# Altium schematic sheet CAN.SchDoc
size A4; DocumentNumber: 6; SheetNumber: 6; SheetTotal: 8
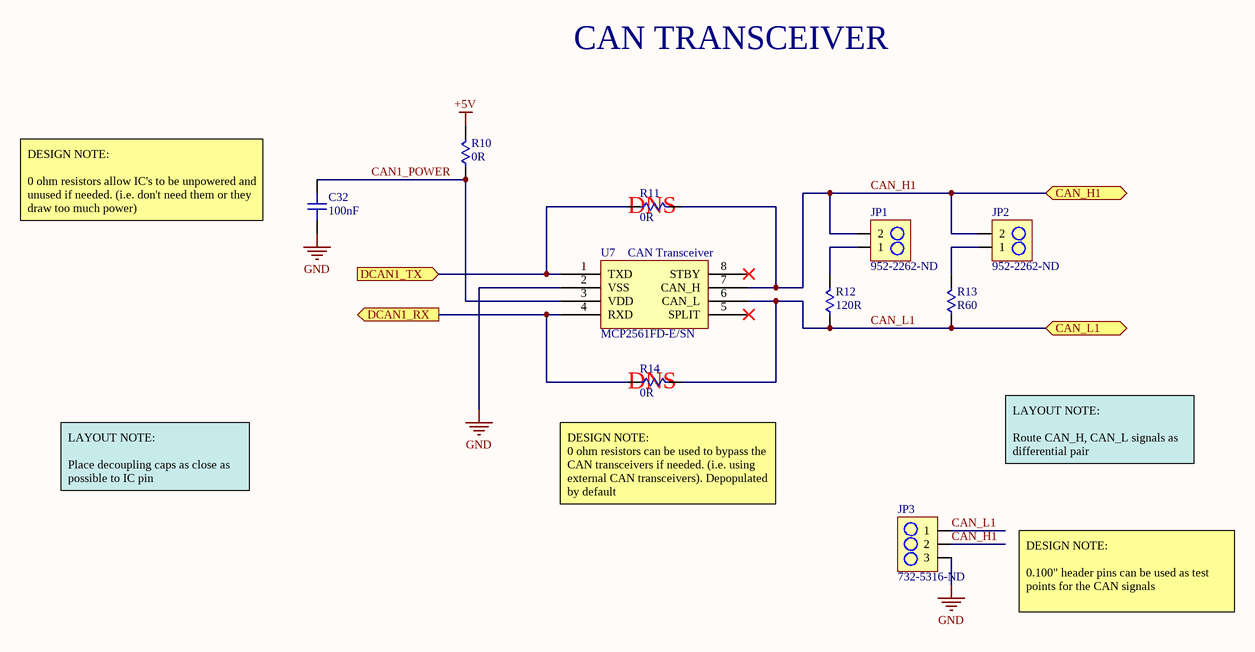
[diagram p0: CAN.SchDoc]

## Parts
C32  100nF  [C0402]
JP1  952-2262-ND  [2PIN_HEADER]
JP2  952-2262-ND  [2PIN_HEADER]
JP3  732-5316-ND  [3PIN_HEADER]
R10  0R  [R0402]
R11  0R  [R0402]
R12  120R  [R0402]
R13  R60  [R0402]
R14  0R  [R0402]
U7  MCP2561FD-E/SN  [8-SOIC_MCP2561]

## Ports
CAN_H1, CAN_L1, DCAN1_RX, DCAN1_TX

## Nets
+5V: R10.2
GND: C32.1 JP3.3 U7.2(VSS)
CAN1_POWER: C32.2 R10.1 U7.3(VDD)
CAN_H1: JP1.2 JP2.2 JP3.2 R11.2 U7.7(CAN_H) ; port CAN_H1
CAN_L1: JP3.1 R12.1 R13.1 R14.2 U7.6(CAN_L) ; port CAN_L1
DCAN1_RX: R14.1 U7.4(RXD) ; port DCAN1_RX
DCAN1_TX: R11.1 U7.1(TXD) ; port DCAN1_TX
NetJP1_1: JP1.1 R12.2
NetJP2_1: JP2.1 R13.2

Not connected (* = marked no-connect by the designer): U7 5(SPLIT)* 8(STBY)*

## Notes on the sheet
- CAN TRANSCEIVER
- DESIGN NOTE:
  0 ohm resistors allow IC's to be unpowered and unused if needed. (i.e. don't need them or they draw too much power)
- (near R11) DNS
- (near U7) CAN Transceiver
- (near R14) DNS
- LAYOUT NOTE:
  Place decoupling caps as close as possible to IC pin
- LAYOUT NOTE:
  Route CAN_H, CAN_L signals as differential pair
- (near R14) DESIGN NOTE:
  0 ohm resistors can be used to bypass the CAN transceivers if needed. (i.e. using external CAN transceivers). Depopulated by default
- DESIGN NOTE:
  0.100" header pins can be used as test points for the CAN signals

## Library data of the parts
C32 = CL05A104MP5NNNC: CAP MLCC 0.1uF 10V X5R 0402 20% SMD 0402 85C Paper T/R; Manufacturer: Samsung; Supplier 1: Digi-Key; Manufacturer Part Number: CL05A104MP5NNNC; Stock 1: 100000; Pricing 1: 1=0.1, 10=0.024, 100=0.0106, 500=0.0076, 1000=0.006, 2500=0.0054, 5000=0.005 (USD); Mount: Surface Mount; Case/Package: 0402; Case Code (Metric): 1005; Case Code (Imperial): 0402; Min Operating Temperature: -55°C; Max Operating Temperature: 85°C; Packaging: Tape and Reel; Capacitance: 100nF; Tolerance: 20%; Voltage Rating: 10V; Dielectric: X5R; Voltage Rating (DC): 10V; Length: 1mm; Height: 0.5mm; Width: 0.02inch; Thickness: 0.022inch; Depth: 0.5mm; Radiation Hardening: No; Lead Free: Lead Free; ComponentLink1URL: https://media.digikey.com/pdf/Data%20Sheets/Samsung%20PDFs/CL_Series_MLCC_ds.pdf; ComponentLink1Description: https://media.digikey.com/pdf/Data%20Sheets/Samsung%20PDFs/CL_Series_MLCC_ds.pdf; Supplier Part Number 1: 1276-1443-1-ND
JP1 JP2 = M20-9990246: CONN_HeaderPins2pos Headers & Wire Housings 02 SIL VERTICAL PIN HEADER TIN; Manufacturer: Harwin; Contact Resistance: 30mR; Max Current Rating: 3A; Number of Positions: 2; Gender: Male; Connector Type: Male Pin; Insulation Resistance: 10GR; Voltage Rating (AC): 750V; Pitch: 2.54mm; Supplier 1: Digi-Key; Manufacturer Part Number: M20-9990246; Stock 1: 53577; Pricing 1: 1=0.11, 10=0.099, 100=0.0609, 500=0.0504, 1000=0.0441, 5000=0.0378, 10000=0.0368 (USD); Case/Package: SIL; Colour: Black; Housing Colour: Black; Housing Material: Nylon; Contact Plating: Tin; Contact Material: Bronze,Brass; Min Operating Temperature: -40°C; Max Operating Temperature: 105°C; Package Quantity: 1000; Packaging: Bulk; Termination: Solder; Number of Rows: 1; Number of Contacts: 2; Orientation: Straight; Current Rating: 3A; Length: 5.08mm; Depth: 2.54mm; Contact Mating Length: 0.24inch; Radiation Hardening: No; REACH SVHC: No SVHC; ComponentLink1URL: https://datasheet.ciiva.com/8046/315376-8046930.pdf; ComponentLink1Description: https://datasheet.ciiva.com/8046/315376-8046930.pdf; ComponentLink2URL: https://datasheet.ciiva.com/6833/m20-999-6833368.pdf; ComponentLink2Description: https://datasheet.ciiva.com/6833/m20-999-6833368.pdf; ComponentLink3URL: https://datasheet.ciiva.com/11745/0900766b81034e61-11745755.pdf; ComponentLink3Description: https://datasheet.ciiva.com/11745/0900766b81034e61-11745755.pdf; ComponentLink4URL: https://datasheet.ciiva.com/22660/1830818-22660571.pdf; ComponentLink4Description: https://datasheet.ciiva.com/22660/1830818-22660571.pdf; ComponentLink5URL: https://datasheet.ciiva.com/26852/getdatasheetpartid-384170-26852203.pdf; ComponentLink5Description: https://datasheet.ciiva.com/26852/getdatasheetpartid-384170-26852203.pdf; Supplier Part Number 1: 952-2262-ND
JP3 = 61300311121: CONN_HeaderPins3pos WURTH ELEKTRONIK Board-To-Board Connector, Vertical, WR-PHD Series, Through Hole, Header, 3 Contacts, 2.54 mm; Manufacturer: Wurth Electronics; Number of Positions: 3; Gender: Male; Connector Type: Male Pin; Pitch: 0.1inch; Supplier 1: Digi-Key; Manufacturer Part Number: 61300311121; Stock 1: 57026; Pricing 1: 1=0.13, 10=0.106, 25=0.088, 50=0.074, 100=0.067, 1000=0.061 (USD); Mount: Through Hole; Case/Package: 100; Contact Plating: Gold; Contact Material: Copper; Colour: Black; Number of Rows: 1; Packaging: Bulk; Termination: Solder; Number of Contacts: 3; Contact Mating Length: 0.236inch; REACH SVHC: Unknown; Lead Free: Lead Free; ComponentLink1URL: http://www.farnell.com/cad/1737268.pdf; ComponentLink1Description: http://www.farnell.com/cad/1737268.pdf; Supplier Part Number 1: 732-5316-ND
R10 R11 R14 = RC0402JR-070RL: RES SMD 0 OHM 1/16W 0402; Manufacturer: Yageo; Resistance: 0mR; Power Rating: 62.5mW; Tolerance: 5%; Voltage Rating: 50V; Max Power Dissipation: 63mW; Temperature Coefficient: 200ppm/°C; Supplier 1: Digi-Key; Manufacturer Part Number: RC0402JR-070RL; Stock 1: 44333412; Pricing 1: 1=0.1, 10=0.017, 25=0.0124, 50=0.0096, 100=0.007, 250=0.0054, 500=0.0043, 1000=0.0032, 5000=0.0023 (USD); Case/Package: 0402; Contact Plating: Matte,Tin; Case Code (Metric): 1005; Case Code (Imperial): 0402; Min Operating Temperature: -55°C; Max Operating Temperature: 155°C; Packaging: Tape and Reel; Composition: Thick Film; Package Quantity: 1; Number of Terminations: 2; Termination: SMD/SMT; Military Standard: Not; Features: Moisture Resistant; Length: 1mm; Height: 0.016inch; Width: 0.02inch; Depth: 0.5mm; Radiation Hardening: No; REACH SVHC: Unknown; Lead Free: Lead Free; Supplier Part Number 1: 311-0.0JRCT-ND
R12 = RMCF0402JT120R: RES SMD 120 OHM 5% 0402 1/16W ±100ppm/C Molded SMD Paper T/R; Manufacturer: Stackpole Electronics; Power Rating: 62.5mW; Max Power Dissipation: 63mW; Temperature Coefficient: 100ppm/°C; Supplier 1: Digi-Key; Manufacturer Part Number: RMCF0402JT120R; Stock 1: 112024; Pricing 1: 1=0.1, 10=0.012, 100=0.005, 1000=0.0022, 2500=0.002, 5000=0.0016 (USD); Mount: Surface Mount; Case/Package: 0402; Case Code (Metric): 1005; Case Code (Imperial): 0402; Contact Plating: Matte,Tin; Min Operating Temperature: -55°C; Max Operating Temperature: 155°C; Tolerance: 5%; Packaging: Cut Tape; Resistance: 120R; Composition: Thick Film; Number of Terminations: 2; Features: Automotive AEC-Q200; Length: 0.039inch; Height: 0.016inch; Width: 0.02inch; Lead Free: Lead Free; Supplier Part Number 1: RMCF0402JT120RCT-ND
R13 = RMCF0402FT60R4: RES SMD 60.4 OHM 1% 0402 1/16W 100ppm/C Molded SMD SMD Paper T/R; Manufacturer: Stackpole Electronics; Resistance: 60.4R; Max Power Dissipation: 63mW; Temperature Coefficient: 100ppm/°C; Supplier 1: Digi-Key; Manufacturer Part Number: RMCF0402FT60R4; Stock 1: 29830; Pricing 1: 1=0.1, 10=0.016, 100=0.0064, 1000=0.0029, 2500=0.0025, 5000=0.0021 (USD); Mount: Surface Mount; Case/Package: 0402; Case Code (Metric): 1005; Case Code (Imperial): 0402; Contact Plating: Matte,Tin; Min Operating Temperature: -55°C; Max Operating Temperature: 155°C; Packaging: Tape and Reel; Tolerance: 1%; Composition: Thick Film; Number of Terminations: 2; Features: Automotive AEC-Q200; Length: 0.039inch; Height: 0.016inch; Width: 0.02inch; Radiation Hardening: No; Lead Free: Lead Free; Supplier Part Number 1: RMCF0402FT60R4CT-ND
U7 = MCP2561FD-E/SN: IC CAN Bus, Transceiver, CAN, 1, 1, 4.5 V, 5.5 V, SOIC; Manufacturer: Microchip; Number of Receivers: 1; Data Rate: 8Mbps; Min Supply Voltage: 4.5V; Max Supply Voltage: 5.5V; Max Supply Current: 70mA; Receiver Hysteresis: 200mV; Supplier 1: Digi-Key; Manufacturer Part Number: MCP2561FD-E/SN; Stock 1: 1072; Pricing 1: 1=0.97, 25=0.8084, 100=0.735 (USD); Case/Package: SOIC; Number of Pins: 8; Weight: 0.019048oz; Min Operating Temperature: -40°C; Max Operating Temperature: 125°C; Packaging: Rail/Tube; Number of Transceivers: 1; Logic Function: Transceiver; Interface: CAN; Number of Drivers: 1; Number of Transmit Buffers: 1; Number of Receive Buffers: 1; Operating Supply Current: 70mA; Package Quantity: 100; Length: 4.9mm; Height: 1.5mm; Width: 3.9mm; REACH SVHC: No SVHC; Lead Free: Lead Free; ComponentLink1URL: https://datasheet.ciiva.com/48512/mcp2561fd-eng-tds-48512069.pdf; ComponentLink1Description: https://datasheet.ciiva.com/48512/mcp2561fd-eng-tds-48512069.pdf; ComponentLink2URL: https://datasheet.ciiva.com/46406/1821190-46406024.pdf; ComponentLink2Description: https://datasheet.ciiva.com/46406/1821190-46406024.pdf; ComponentLink3URL: https://datasheet.ciiva.com/46406/1821190-46406056.pdf; ComponentLink3Description: https://datasheet.ciiva.com/46406/1821190-46406056.pdf; ComponentLink4URL: https://datasheet.ciiva.com/48473/20005284a-48473177.pdf; ComponentLink4Description: https://datasheet.ciiva.com/48473/20005284a-48473177.pdf